# EAGLE design fitnessBuddy-TOP (EAGLE 9.6.2)
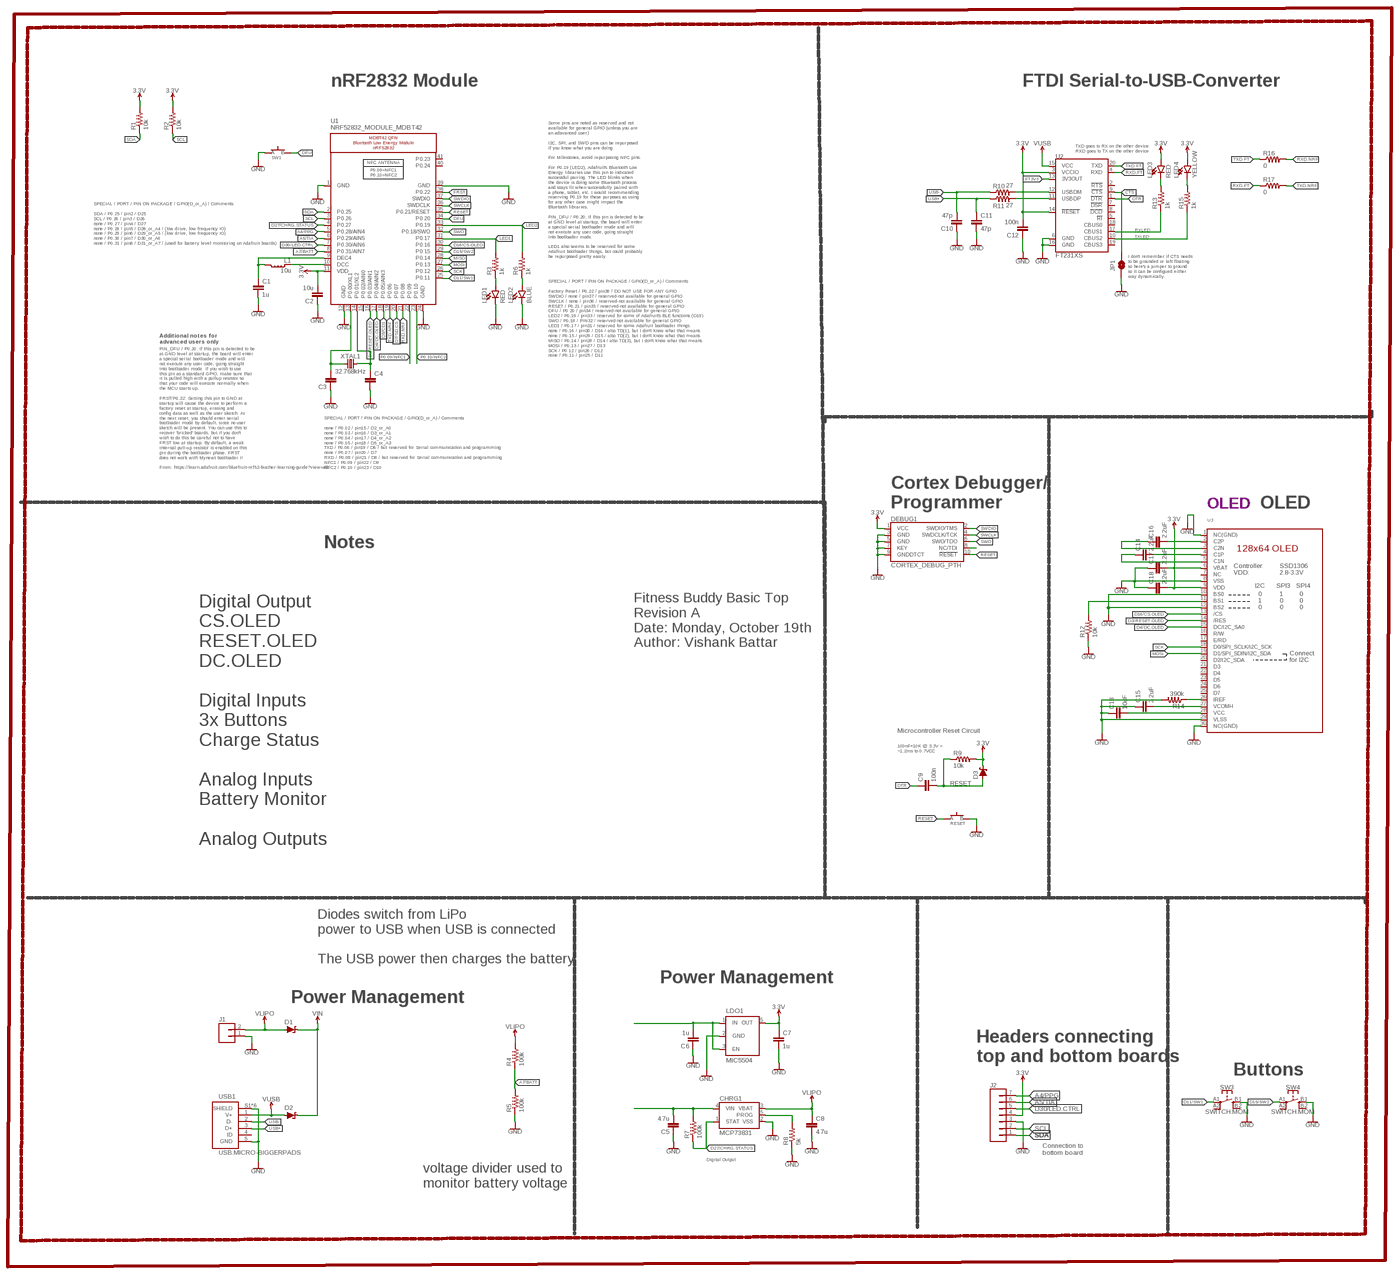
[diagram p0: schematic, sheet 1, overview]
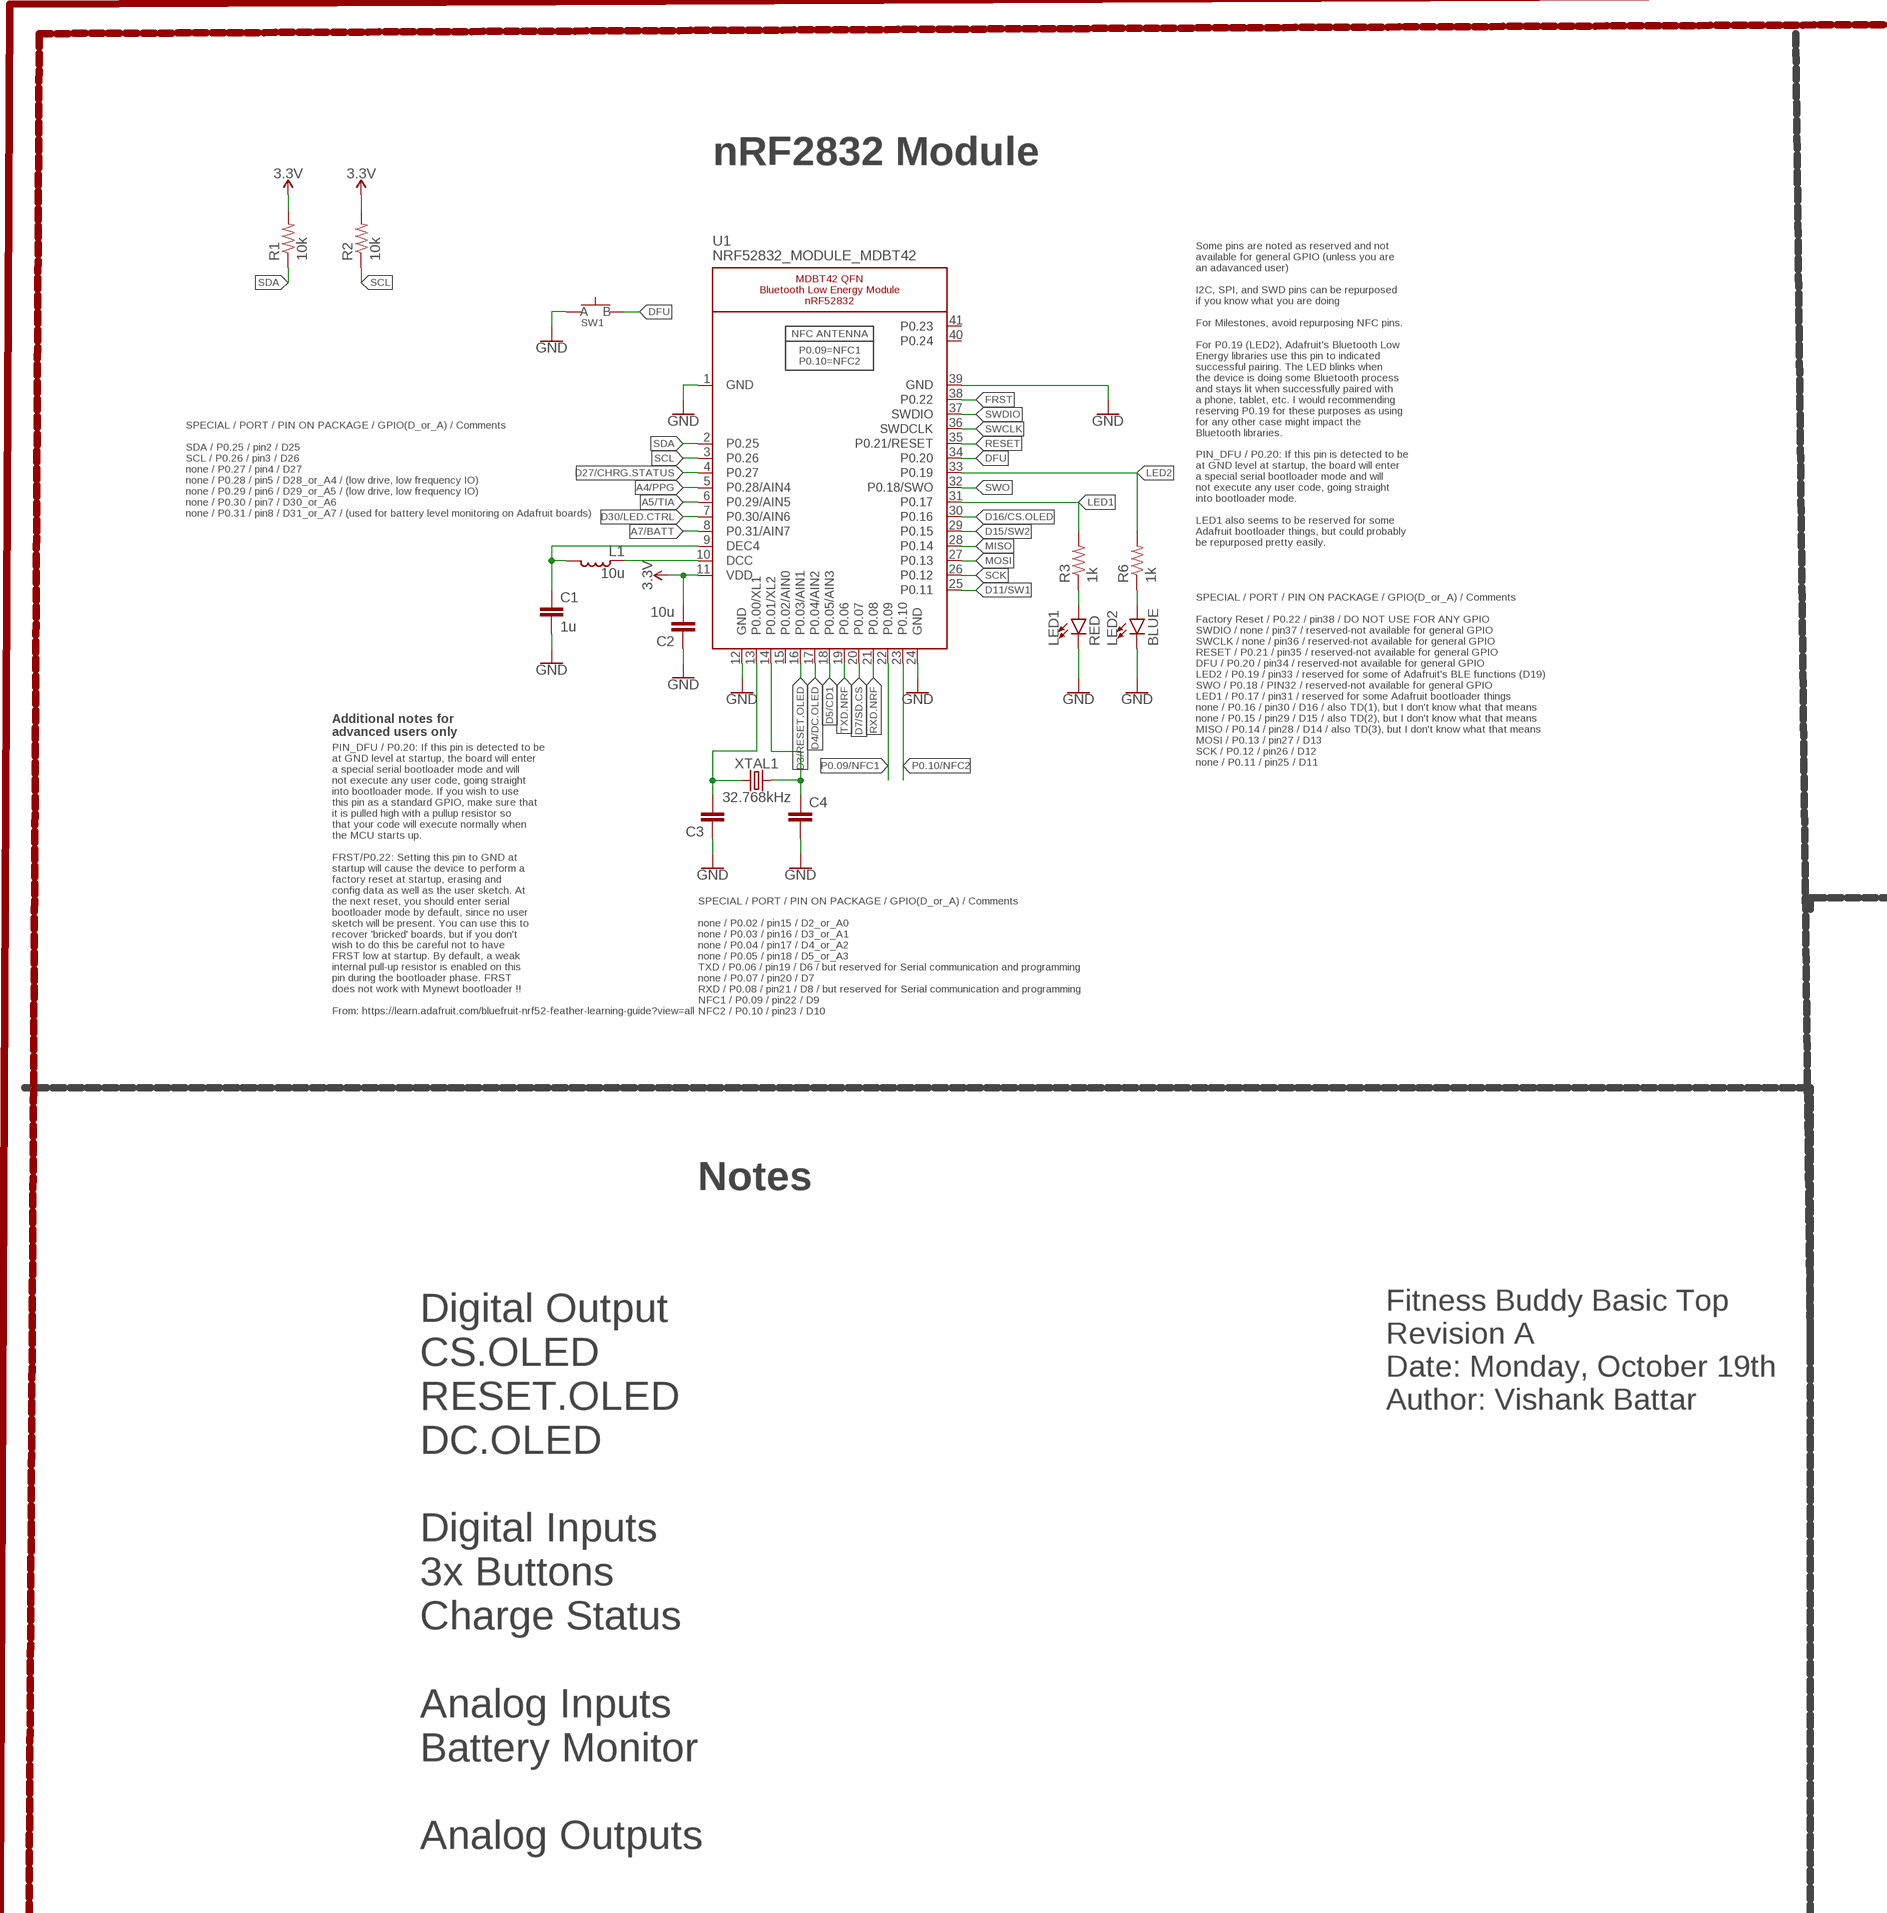
[diagram p1: schematic, sheet 1, part 1 of 4]
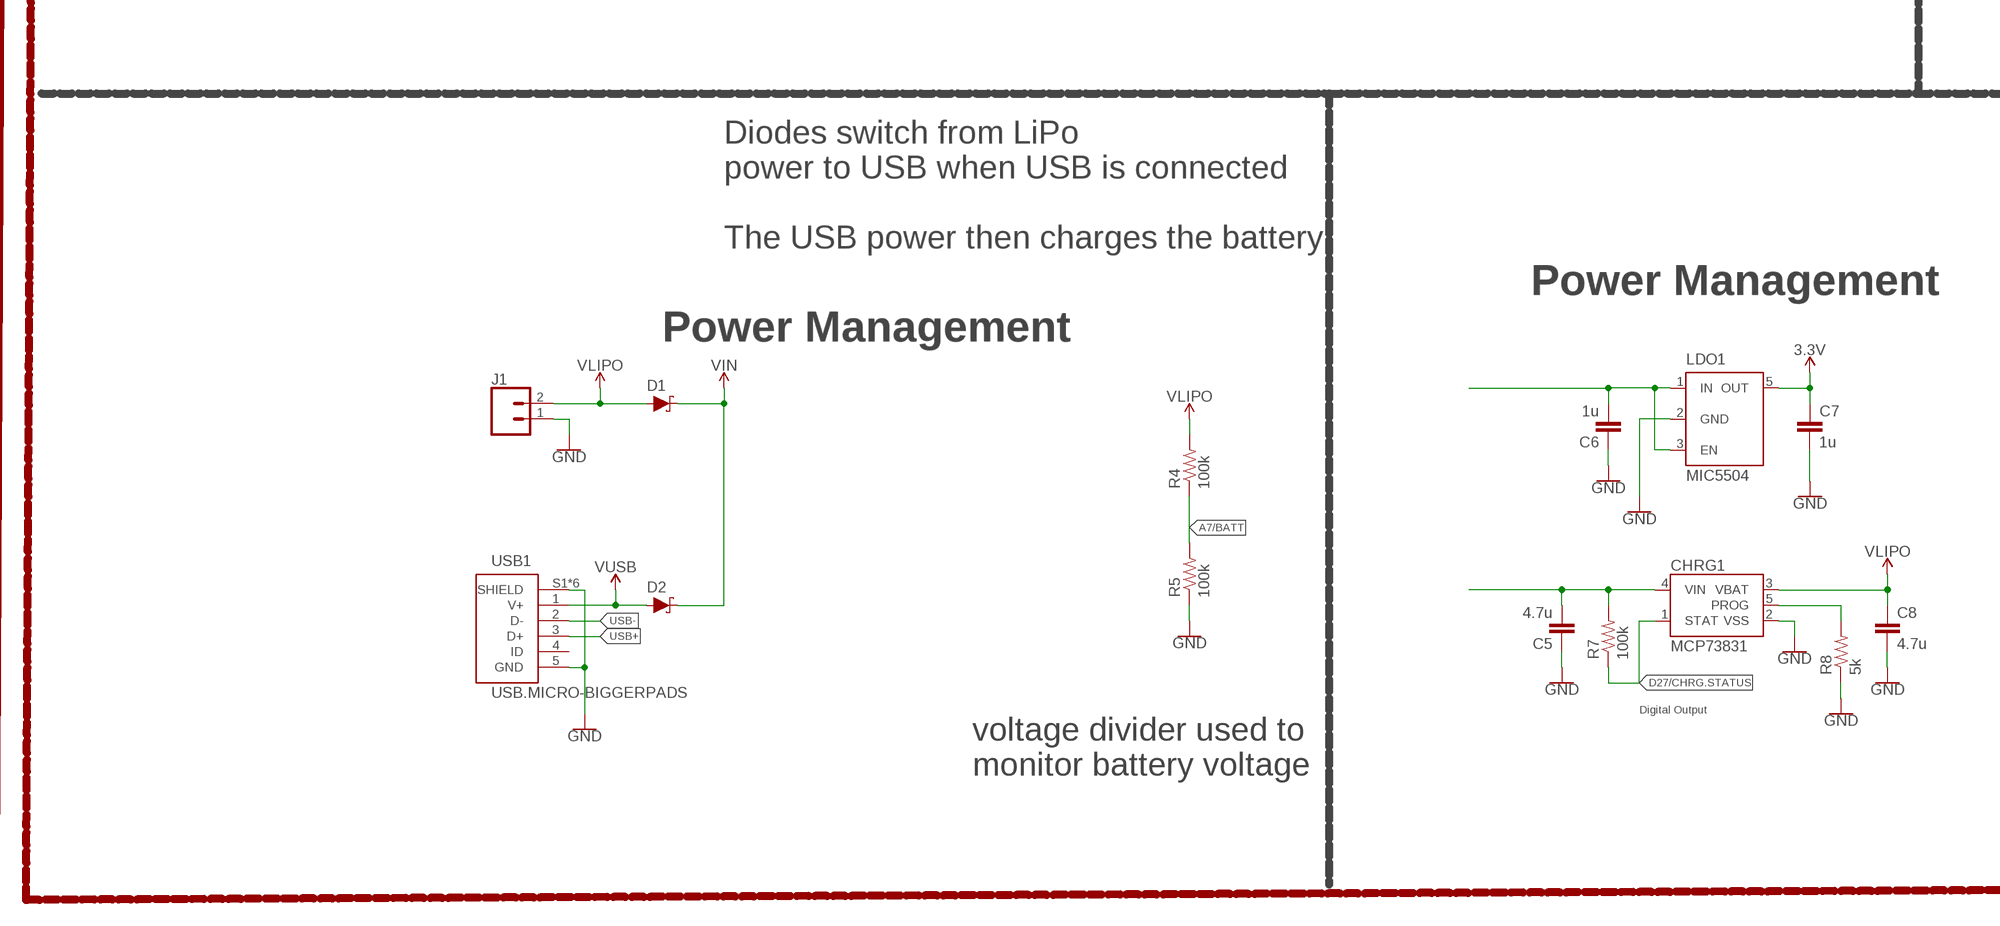
[diagram p2: schematic, sheet 1, part 2 of 4]
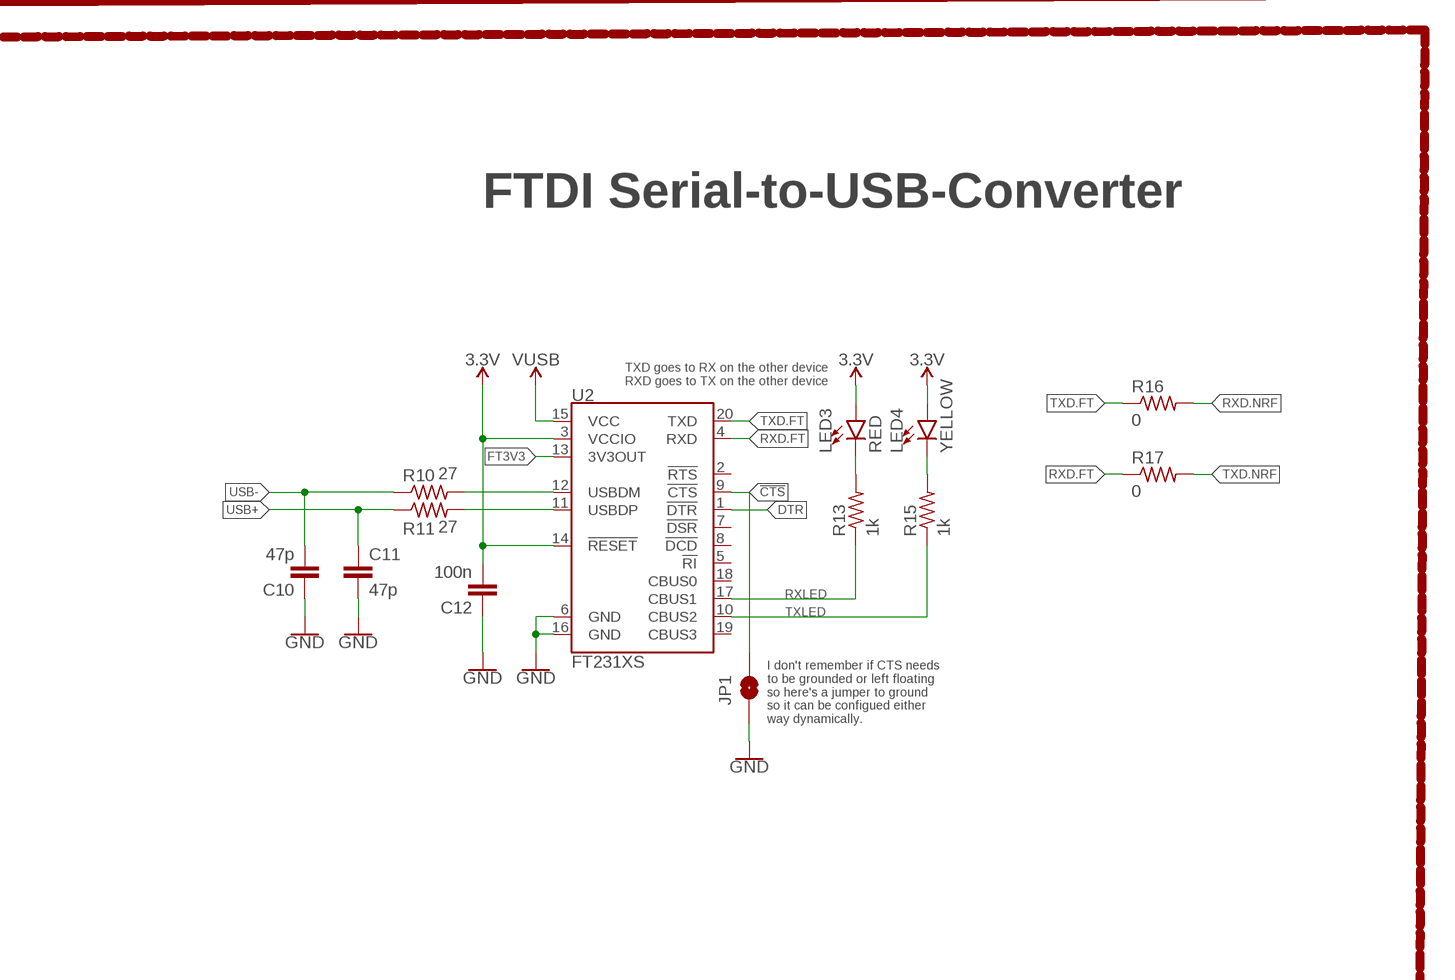
[diagram p3: schematic, sheet 1, part 3 of 4]
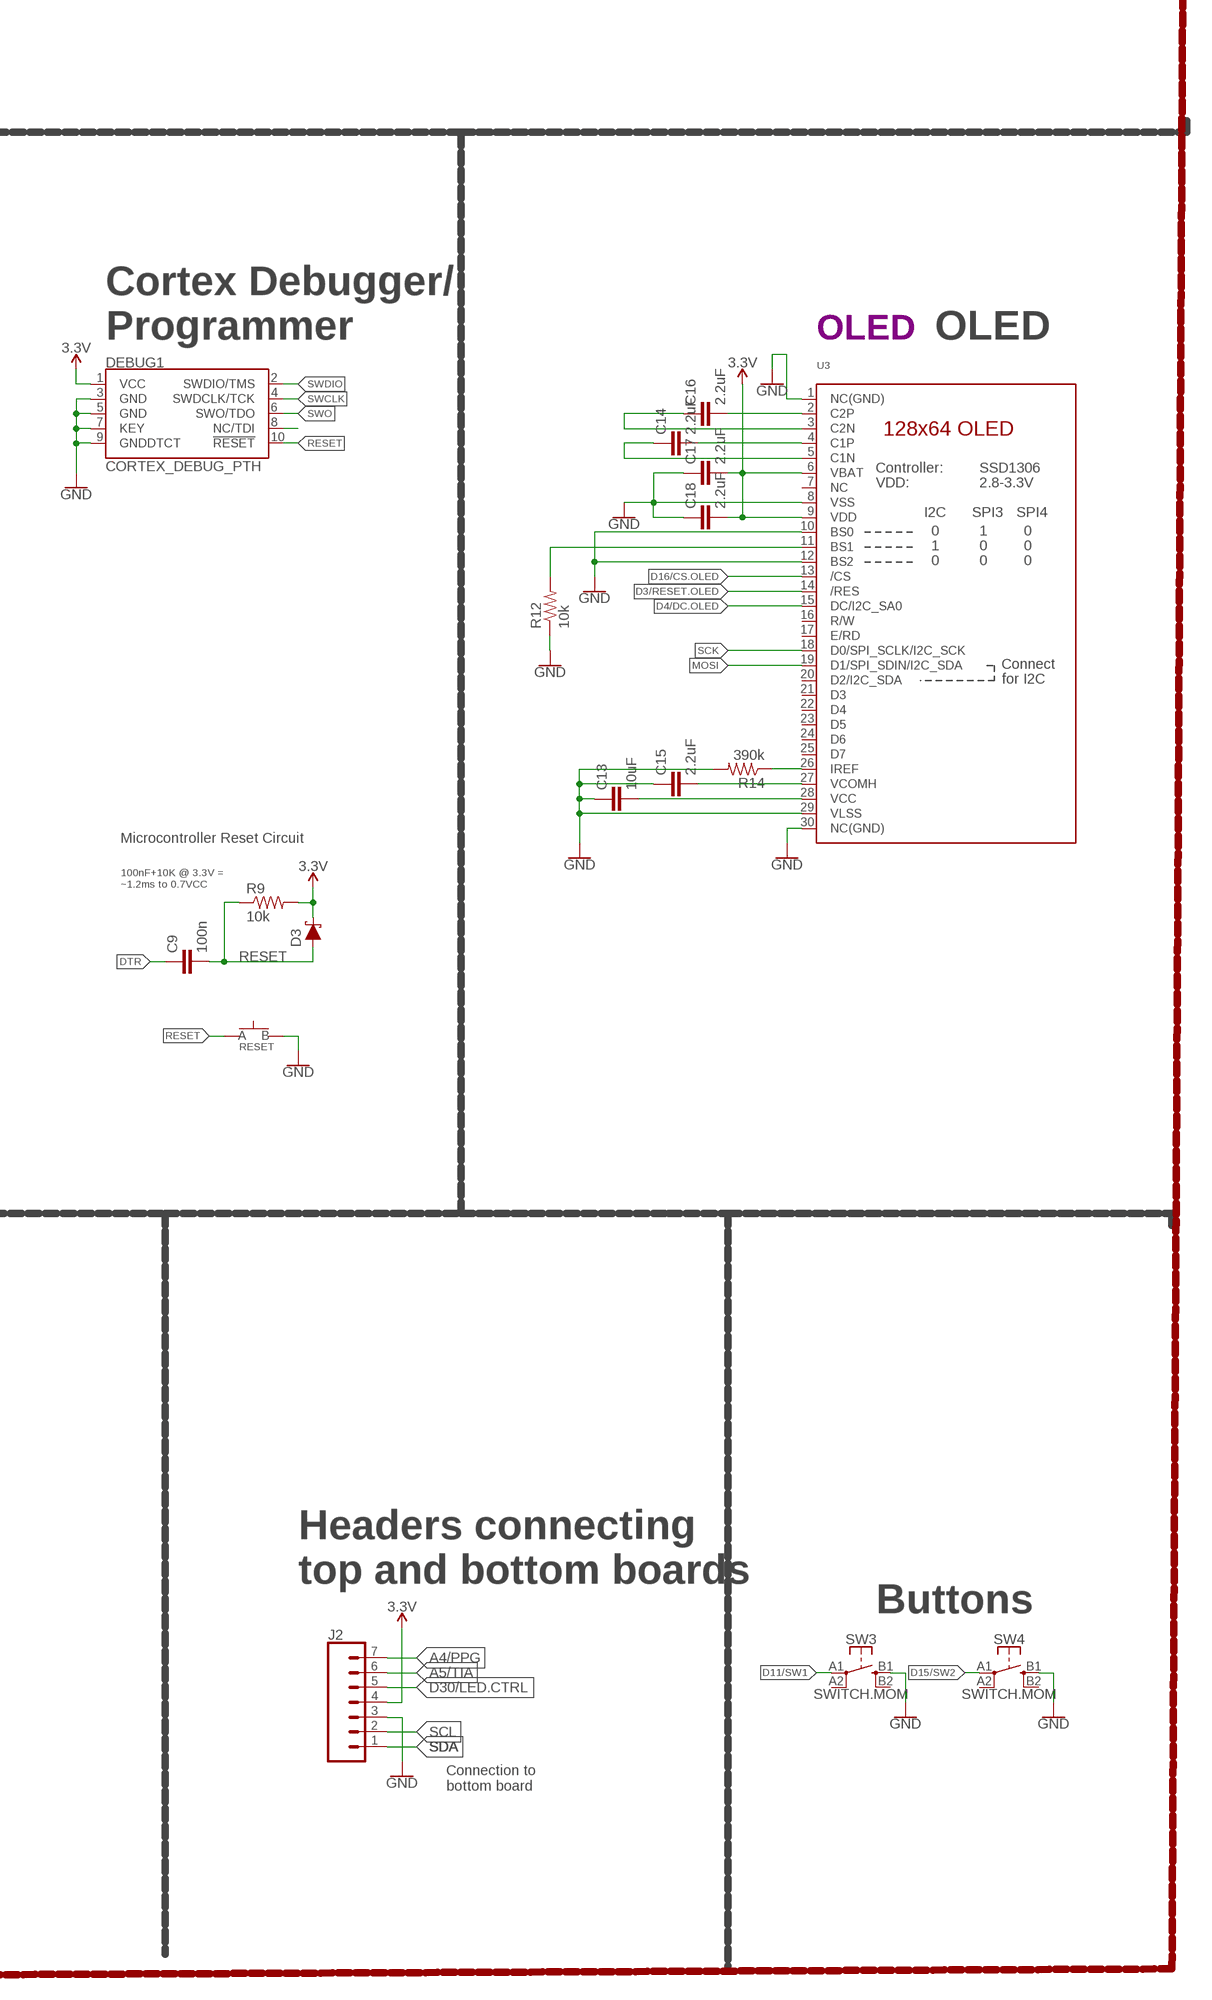
[diagram p4: schematic, sheet 1, part 4 of 4]

## Parts
C1  1u  CAPACITOR0603  [C0603]
C2  10u  CAPACITOR0805  [C0805]
C3  CAPACITOR0603  [C0603]
C4  CAPACITOR0603  [C0603]
C5  4.7u  CAPACITOR0603  [C0603]
C6  1u  CAPACITOR0603  [C0603]
C7  1u  CAPACITOR0603  [C0603]
C8  4.7u  CAPACITOR0603  [C0603]
C9  100n  CAPACITOR0603  [C0603]
C10  47p  CAPACITOR0603  [C0603]
C11  47p  CAPACITOR0603  [C0603]
C12  100n  CAPACITOR0603  [C0603]
C13  10uF  CAPACITOR0603  [C0603]
C14  2.2uF  CAPACITOR0402  [C0402]
C15  2.2uF  CAPACITOR0603  [C0603]
C16  2.2uF  CAPACITOR0402  [C0402]
C17  2.2uF  CAPACITOR0402  [C0402]
C18  2.2uF  CAPACITOR0402  [C0402]
CHRG1  MCP73831  [SOT23-5]
D1  SCHOTTKY-USC  [USC]
D2  SCHOTTKY-USC  [USC]
D3  SCHOTTKY-USC  [USC]
DEBUG1  CORTEX_DEBUG_PTH  [2X5-PTH-1.27MM]
J1  CONN_02  [1X02]
J2  CONN_07-1.27MM  [1X07_1.27MM]
JP1  JUMPER-SMT_2_NO_SILK  [SMT-JUMPER_2_NO_SILK]
L1  10u  INDUCTOR0603  [L0603]
LDO1  MIC5504  [SOT23-5]
LED1  RED  LED0603  [LED-0603]
LED2  BLUE  LED0603  [LED-0603]
LED3  RED  LED0603  [LED-0603]
LED4  YELLOW  LED0603  [LED-0603]
R1  10k  RESISTOR0603  [R0603]
R2  10k  RESISTOR0603  [R0603]
R3  1k  RESISTOR0603  [R0603]
R4  100k  RESISTOR0603  [R0603]
R5  100k  RESISTOR0603  [R0603]
R6  1k  RESISTOR0603  [R0603]
R7  100k  RESISTOR0603  [R0603]
R8  5k  RESISTOR0603  [R0603]
R9  10k  RESISTOR0603  [R0603]
R10  27  RESISTOR0603  [R0603]
R11  27  RESISTOR0603  [R0603]
R12  10k  RESISTOR0603  [R0603]
R13  1k  RESISTOR0603  [R0603]
R14  390k  RESISTOR0603  [R0603]
R15  1k  RESISTOR0603  [R0603]
R16  0  RESISTOR0603  [R0603]
R17  0  RESISTOR0603  [R0603]
RESET  SPST-PTS830GG140-COPY.1-3  [BUTTON-GULLWING]
SW1  SPST-PTS830GG140-COPY.1-3  [BUTTON-GULLWING]
SW3  SWITCH.MOM  [TACTILE_SWITCH_SMD_6.2MM_TALL]
SW4  SWITCH.MOM  [TACTILE_SWITCH_SMD_6.2MM_TALL]
U1  NRF52832_MODULE_MDBT42  [BLE_MODULE_RAYTAC_MDBT42]
U2  FT231XS  [SSOP20_L]
U3  DISP_OLED_UG-2864HSWEG01-NO-WRAPAROUND  [UG-2864HSWEG01_0.96IN_NO-WRAPAROUND]
USB1  USB.MICRO-BIGGERPADS  [USB-MICRO-01.BIGGERPADS]
XTAL1  32.768kHz  CRYSTALECS-.327-12.5-12-C-TR  [2-SMD.NOLEAD.2.0MMTO1.2MM]

## Nets
3.3V: C2.2 C7.1 C12.2 C17.2 C18.2 D3.-(C) DEBUG1.1(VCC) J2.4 LDO1.5(OUT) LED3.A LED4.A R1.2 R2.2 R9.2 U1.11(VDD) U2.3(VCCIO) U2.14(!RESET) U3.6(VBAT) U3.9(VDD)
!CTS: JP1.2 U2.9(!CTS)
A4/PPG: J2.7 U1.5(P0.28/AIN4)
A5/TIA: J2.6 U1.6(P0.29/AIN5)
A7/BATT: R4.1 R5.2 U1.8(P0.31/AIN7)
D3/RESET.OLED: U1.16(P0.03/AIN1) U3.14(/RES)
D4/DC.OLED: U1.17(P0.04/AIN2) U3.15(DC/I2C_SA0)
D5/CD1: U1.18(P0.05/AIN3)
D7/SD.CS: U1.20(P0.07)
D11/SW1: SW3.A1 U1.25(P0.11)
D15/SW2: SW4.A1 U1.29(P0.15)
D16/CS.OLED: U1.30(P0.16) U3.13(/CS)
D27/CHRG.STATUS: CHRG1.1(STAT) R7.1 U1.4(P0.27)
D30/LED.CTRL: J2.5 U1.7(P0.30/AIN6)
DFU: SW1.3(B) U1.34(P0.20)
DTR: C9.1 U2.1(!DTR)
FRST: U1.38(P0.22)
FT3V3: U2.13(3V3OUT)
GND: C1.2 C2.1 C3.1 C4.2 C5.1 C6.1 C7.2 C8.2 C10.1 C11.2 C12.1 C13.1 C15.1 C17.1 C18.1 CHRG1.2(VSS) DEBUG1.3(GND) DEBUG1.5(GND) DEBUG1.7(KEY) DEBUG1.9(GNDDTCT) J1.1 J2.3 JP1.1 LDO1.2(GND) LED1.C LED2.C R5.1 R8.1 R12.1 R14.2 RESET.3(B) SW1.1(A) SW3.B1 SW4.B1 U1.1(GND) U1.12(GND) U1.24(GND) U1.39(GND) U2.6(GND) U2.16(GND) U3.1(NC(GND)) U3.8(VSS) U3.10(BS0) U3.12(BS2) U3.29(VLSS) U3.30(NC(GND)) USB1.5(GND) USB1.S1(SHIELD) USB1.S2(SHIELD) USB1.S3(SHIELD) USB1.S4(SHIELD) USB1.S5(SHIELD) USB1.S6(SHIELD)
LED1: R3.2 U1.31(P0.17)
LED2: R6.2 U1.33(P0.19)
MISO: U1.28(P0.14)
MOSI: U1.27(P0.13) U3.19(D1/SPI_SDIN/I2C_SDA)
N$1: R12.2 U3.11(BS1)
N$2: R14.1 U3.26(IREF)
N$3: C16.2 U3.2(C2P)
N$4: C3.2 U1.13(P0.00/XL1) XTAL1.P$1
N$5: C16.1 U3.3(C2N)
N$6: C4.1 U1.14(P0.01/XL2) XTAL1.P$2
N$7: C14.2 U3.4(C1P)
N$8: C14.1 U3.5(C1N)
N$9: LED1.A R3.1
N$10: LED2.A R6.1
N$11: L1.1 U1.10(DCC)
N$12: C1.1 L1.2 U1.9(DEC4)
N$13: C13.2 U3.28(VCC)
N$14: DEBUG1.8(NC/TDI)
N$15: C15.2 U3.27(VCOMH)
N$16: CHRG1.5(PROG) R8.2
N$17: C5.2 CHRG1.4(VIN) R7.2
N$23: R10.2 U2.12(USBDM)
N$24: R11.2 U2.11(USBDP)
N$25: LED3.C R13.2
N$26: LED4.C R15.2
P0.09/NFC1: U1.22(P0.09)
P0.10/NFC2: U1.23(P0.10)
RESET: C9.2 D3.+(A) DEBUG1.10(!RESET) R9.1 RESET.1(A) U1.35(P0.21/RESET)
RXD.FT: R17.1 U2.4(RXD)
RXD.NRF: R16.2 U1.21(P0.08)
RXLED: R13.1 U2.17(CBUS1)
SCK: U1.26(P0.12) U3.18(D0/SPI_SCLK/I2C_SCK)
SCL: J2.2 R2.1 U1.3(P0.26)
SDA: J2.1 R1.1 U1.2(P0.25)
SWCLK: DEBUG1.4(SWDCLK/TCK) U1.36(SWDCLK)
SWDIO: DEBUG1.2(SWDIO/TMS) U1.37(SWDIO)
SWO: DEBUG1.6(SWO/TDO) U1.32(P0.18/SWO)
TXD.FT: R16.1 U2.20(TXD)
TXD.NRF: R17.2 U1.19(P0.06)
TXLED: R15.1 U2.10(CBUS2)
USB+: C11.1 R11.1 USB1.3(D+)
USB-: C10.2 R10.1 USB1.2(D-)
V_USB: D2.+(A) U2.15(VCC) USB1.1(V+) ; supply symbol labelled VUSB
VIN: C6.2 D1.-(C) D2.-(C) LDO1.1(IN) LDO1.3(EN)
VLIPO: C8.1 CHRG1.3(VBAT) D1.+(A) J1.2 R4.2
Unconnected: SW3.A2 SW3.B2 SW4.A2 SW4.B2 U1.15(P0.02/AIN0) U1.40(P0.24) U1.41(P0.23) U2.2(!RTS) U2.5(!RI) U2.7(!DSR) U2.8(!DCD) U2.18(CBUS0) U2.19(CBUS3) U3.7(NC) U3.16(R/W) U3.17(E/RD) U3.20(D2/I2C_SDA) U3.21(D3) U3.22(D4) U3.23(D5) U3.24(D6) U3.25(D7) USB1.4(ID)

## Notes on the sheet
- nRF2832 Module | FTDI Serial-to-USB-Converter
- TXD goes to RX on the other device
  RXD goes to TX on the other device
- SPECIAL / PORT / PIN ON PACKAGE / GPIO(D_or_A) / Comments
  
  SDA / P0.25 / pin2 / D25
  SCL / P0.26 / pin3 / D26
  none / P0.27 / pin4 / D27
  none / P0.28 / pin5 / D28_or_A4 / (low drive, low frequency IO)
  none / P0.29 / pin6 / D29_or_A5 / (low drive, low frequency IO)
  none / P0.30 / pin7 / D30_or_A6
  none / P0.31 / pin8 / D31_or_A7 / (used for battery level monitoring on Adafruit boards)
- Some pins are noted as reserved and not
  available for general GPIO (unless you are
  an adavanced user)
  
  I2C, SPI, and SWD pins can be repurposed
  if you know what you are doing
  
  For Milestones, avoid repurposing NFC pins.
  
  For P0.19 (LED2), Adafruit's Bluetooth Low
  Energy libraries use this pin to indicated
  successful pairing. The LED blinks when
  the device is doing some Bluetooth process
  and stays lit when successfully paired with
  a phone, tablet, etc. I would recommending
  reserving P0.19 for these purposes as using
  for any other case might impact the
  Bluetooth libraries.
  
  PIN_DFU / P0.20: If this pin is detected to be
  at GND level at startup, the board will enter
  a special serial bootloader mode and will
  not execute any user code, going straight
  into bootloader mode.
  
  LED1 also seems to be reserved for some
  Adafruit bootloader things, but could probably
  be repurposed pretty easily.
- I don't remember if CTS needs
  to be grounded or left floating
  so here's a jumper to ground
  so it can be configued either
  way dynamically.
- Additional notes for
  advanced users only
- SPECIAL / PORT / PIN ON PACKAGE / GPIO(D_or_A) / Comments
  
  Factory Reset / P0.22 / pin38 / DO NOT USE FOR ANY GPIO
  SWDIO / none / pin37 / reserved-not available for general GPIO
  SWCLK / none / pin36 / reserved-not available for general GPIO
  RESET / P0.21 / pin35 / reserved-not available for general GPIO
  DFU / P0.20 / pin34 / reserved-not available for general GPIO
  LED2 / P0.19 / pin33 / reserved for some of Adafruit's BLE functions (D19)
  SWO / P0.18 / PIN32 / reserved-not available for general GPIO
  LED1 / P0.17 / pin31 / reserved for some Adafruit bootloader things
  none / P0.16 / pin30 / D16 / also TD(1), but I don't know what that means
  none / P0.15 / pin29 / D15 / also TD(2), but I don't know what that means
  MISO / P0.14 / pin28 / D14 / also TD(3), but I don't know what that means
  MOSI / P0.13 / pin27 / D13
  SCK / P0.12 / pin26 / D12
  none / P0.11 / pin25 / D11
- PIN_DFU / P0.20: If this pin is detected to be
  at GND level at startup, the board will enter
  a special serial bootloader mode and will
  not execute any user code, going straight
  into bootloader mode. If you wish to use
  this pin as a standard GPIO, make sure that
  it is pulled high with a pullup resistor so
  that your code will execute normally when
  the MCU starts up.
  
  FRST/P0.22: Setting this pin to GND at
  startup will cause the device to perform a
  factory reset at startup, erasing and
  config data as well as the user sketch. At
  the next reset, you should enter serial
  bootloader mode by default, since no user
  sketch will be present. You can use this to
  recover 'bricked' boards, but if you don't
  wish to do this be careful not to have
  FRST low at startup. By default, a weak
  internal pull-up resistor is enabled on this
  pin during the bootloader phase. FRST
  does not work with Mynewt bootloader !!
  
  From: https://learn.adafruit.com/bluefruit-nrf52-feather-learning-guide?view=all
- SPECIAL / PORT / PIN ON PACKAGE / GPIO(D_or_A) / Comments
  
  none / P0.02 / pin15 / D2_or_A0
  none / P0.03 / pin16 / D3_or_A1
  none / P0.04 / pin17 / D4_or_A2
  none / P0.05 / pin18 / D5_or_A3
  TXD / P0.06 / pin19 / D6 / but reserved for Serial communication and programming
  none / P0.07 / pin20 / D7
  RXD / P0.08 / pin21 / D8 / but reserved for Serial communication and programming
  NFC1 / P0.09 / pin22 / D9
  NFC2 / P0.10 / pin23 / D10
- Cortex Debugger/
  Programmer
- OLED | OLED
- Notes
- Fitness Buddy Basic Top
  Revision A
  Date: Monday, October 19th
  Author: Vishank Battar
- Microcontroller Reset Circuit
- 100nF+10K @ 3.3V =
  ~1.2ms to 0.7VCC
- Digital Output
  CS.OLED
  RESET.OLED
  DC.OLED
  
  Digital Inputs
  3x Buttons
  Charge Status
  
  Analog Inputs
  Battery Monitor
  
  Analog Outputs
- Diodes switch from LiPo
  power to USB when USB is connected
  
  The USB power then charges the battery
- Power Management
- Power Management
- Headers connecting
  top and bottom boards
- Buttons
- Connection to
  bottom board
- Digital Output
- voltage divider used to
  monitor battery voltage

## Library data of the parts
C1-C18 = LinnesLab-Passives:CAPACITOR
CHRG1 = LinnesLab-Power:MCP73831: MCP73831T Li-Ion, Li-Pol Controller Miniature single cell, fully integrated Li-Ion, Li-polymer charge management controller Datasheet <http://ww1.microchip.com/downloads/en/DeviceDoc/20001984g.pdf> SparkFun Products: SparkFun ESP32 Thing <https://www.sparkfun.com/products/13907> SparkFun 9DoF Razor IMU M0 <https://www.sparkfun.com/products/14001>; PROD_ID: IC-09995
D1-D3 = LinnesLab-DiscreteSemi:SCHOTTKY: Schottky diode A Schottky diode is a semiconductor diode which has a low forward voltage drop and a very fast switching action. Example: Digi-Key Part Number: RB161MM-20CT-ND
DEBUG1 = LinnesLab-Connectors:CORTEX_DEBUG: Cortex Debug Connector - 10 pin Supports JTAG debug, Serial Wire debug, and Serial Wire Viewer. PTH and SMD connector options available. General Connector Information <http://infocenter.arm.com/help/topic/com.arm.doc.faqs/attached/13634/cortex_debug_connectors.pdf> Products: PTH Connector <http://www.digikey.com/product-detail/en/cnc-tech/3220-10-0100-00/1175-1627-ND/3883661> -via Digi-Key SparkFun PSoc <https://www.sparkfun.com/products/13229> SparkFun T <https://www.sparkfun.com/products/13810>
J1 = LinnesLab-Connectors:CONN_02: Multi connection point. Often used as Generic Header-pin footprint for 0.1 inch spaced/style header connections On any of the 0.1 inch spaced packages, you can populate with these: Break Away Headers - Straight <https://www.sparkfun.com/products/116> (PRT-00116) Break Away Male Headers - Right Angle <https://www.sparkfun.com/products/553> (PRT-00553) Female Headers <https://www.sparkfun.com/products/115> (PRT-00115) Break Away Headers - Machine Pin <https://www.sparkfun.com/products/117> (PRT-00117) Break Away Female Headers - Swiss Machine Pin <https://www.sparkfun.com/products/743> (PRT-00743) For SCREWTERMINALS and SPRING TERMINALS visit here: Screw Terimnals on SparkFun.com <https://www.sparkfun.com/search/results?term=Screw+Terminals> (5mm/3.5mm/2.54mm spacing) This device is also useful as a general connection point to wire up your design to another part of your project. Our various solder wires solder well into these plated through hole pads. Hook-Up Wire - Assortment (Stranded, 22 AWG) <https://www.sparkfun.com/products/11375> (PRT-11375) Hook-Up Wire - Assortment (Solid Core, 22 AWG) <https://www.sparkfun.com/products/11367> (PRT-11367) View the entire wire category on our website here <https://www.sparkfun.com/categories/141> Special notes: Molex polarized connector foot print use with: PRT-08233 with associated crimp pins and housings. 2.54_SCREWTERM for use with PRT-10571. 3.5mm Screw Terminal footprints for PRT-08084 5mm Screw Terminal footprints for use with PRT-08432
J2 = LinnesLab-Connectors:CONN_07: Multi connection point. Often used as Generic Header-pin footprint for 0.1 inch spaced/style header connections On any of the 0.1 inch spaced packages, you can populate with these: Break Away Headers - Straight <https://www.sparkfun.com/products/116> (PRT-00116) Break Away Male Headers - Right Angle <https://www.sparkfun.com/products/553> (PRT-00553) Female Headers <https://www.sparkfun.com/products/115> (PRT-00115) Break Away Headers - Machine Pin <https://www.sparkfun.com/products/117> (PRT-00117) Break Away Female Headers - Swiss Machine Pin <https://www.sparkfun.com/products/743> (PRT-00743) For SCREWTERMINALS and SPRING TERMINALS visit here: Screw Terimnals on SparkFun.com <https://www.sparkfun.com/search/results?term=Screw+Terminals> (5mm/3.5mm/2.54mm spacing) This device is also useful as a general connection point to wire up your design to another part of your project. Our various solder wires solder well into these plated through hole pads. Hook-Up Wire - Assortment (Stranded, 22 AWG) <https://www.sparkfun.com/products/11375> (PRT-11375) Hook-Up Wire - Assortment (Solid Core, 22 AWG) <https://www.sparkfun.com/products/11367> (PRT-11367) View the entire wire category on our website here <https://www.sparkfun.com/categories/141> Special notes: Molex polarized connector foot print use with SKU : PRT-08231 with associated crimp pins and housings. 1MM SMD Version SKU: PRT-10208 NOTES ON THE VARIANTS LOCK and LOCK_LONGPADS... This footprint was designed to help hold the alignment of a through-hole component (i.e. 6-pin header) while soldering it into place. You may notice that each hole has been shifted either up or down by 0.005 of an inch from it's more standard position (which is a perfectly straight line). This slight alteration caused the pins (the squares in the middle) to touch the edges of the holes. Because they are alternating, it causes a "brace" to hold the component in place. 0.005 has proven to be the perfect amount of "off-center" position when using our standard breakaway headers. Although looks a little odd when you look at the bare footprint, once you have a header in there, the alteration is very hard to notice. Also,if you push a header all the way into place, it is covered up entirely on the bottom side.
JP1 = LinnesLab-Switches:JUMPER-SMT_2_NO: Normally open jumper This jumper has two pads in close proximity to each other. Apply solder to close the connection. Round pads are easier to solder for beginners, but are a lot larger. SparkFun Product that uses the round pads: SparkFun EL Sequencer <https://www.sparkfun.com/products/12781>
L1 = LinnesLab-Passives:INDUCTOR
LDO1 = LinnesLab-Power:MIC5504: MIC5504 Voltage Regulator Output Voltages: 1.0V to 3.3V Input Voltages: 2.5V to 5.5V Link to Datasheet http://ww1.microchip.com/downloads/en/DeviceDoc/MIC550X.pdf
LED1-LED4 = LinnesLab-LED:LED: LED (Generic) Standard schematic elements and footprints for 5mm, 3mm, 1206, and 0603 sized LEDs. Generic LEDs with no color specified. LTST-C190KGKT: arrow indicates cathode
R1-R17 = LinnesLab-Passives:RESISTOR
RESET SW1 = LinnesLab-Switches:SPST-PTS830GG140-COPY
SW3 SW4 = LinnesLab-Switches:SWITCH.MOM: PTS645SM43SMTR92 LFS
U1 = LinnesLab-Microcontrollers:NRF52832_MODULE_MDBT42: MDBT42 - BLE Module (nRF52832 QFN) VDD: 1.7-3.6V
U2 = LinnesLab-DigitalIC:FT231X: FTDI FT231X Full Speed USB to Full-handshake UART This USB2.0 Full Speed IC offers a compact bridge to full handshake UART interfaces. The device is a UART, capable of operating up to 3MBaud, with low power consumption (8mA). The FT231X includes the complete FT-X series feature set and enables USB to be added into a system design quickly and easily over a UART interface. Datasheet <http://cdn.sparkfun.com/datasheets/Components/General%20IC/DS_FT231X.pdf>; DIGIKEY: 768-1156-5-ND; MFN: FT231XS-U
U3 = LinnesLab-Displays:DISP_OLED_UG-2864HSWEG01: UG-2864HSWEG01 OLED display Both 1.3" and 0.96" models share the same FPC tab footprint, only the screen dimensions vary.
USB1 = LinnesLab-Connectors:USB.MICRO: DigiKey PN: 609-4613-1-ND
XTAL1 = LinnesLab-Clocks:CRYSTAL

## Board
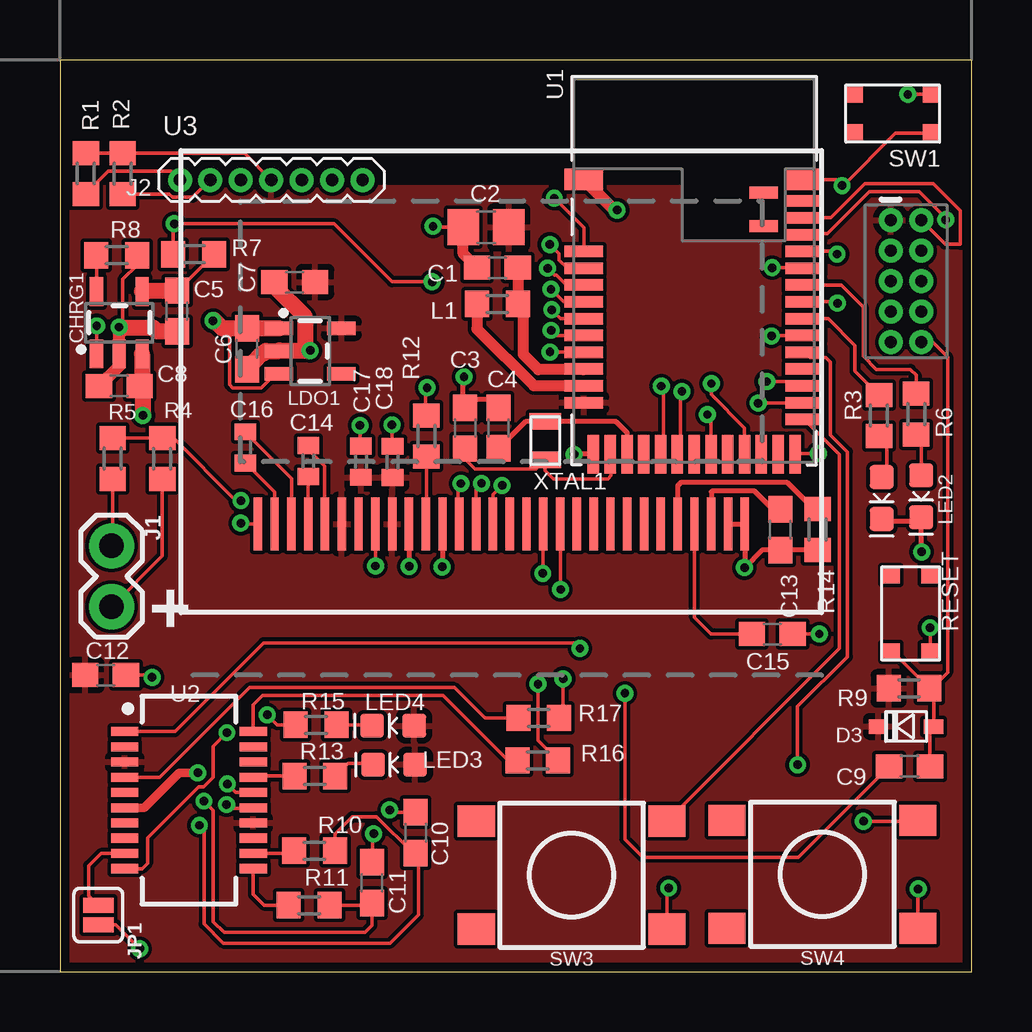
[diagram p5: board, top side]
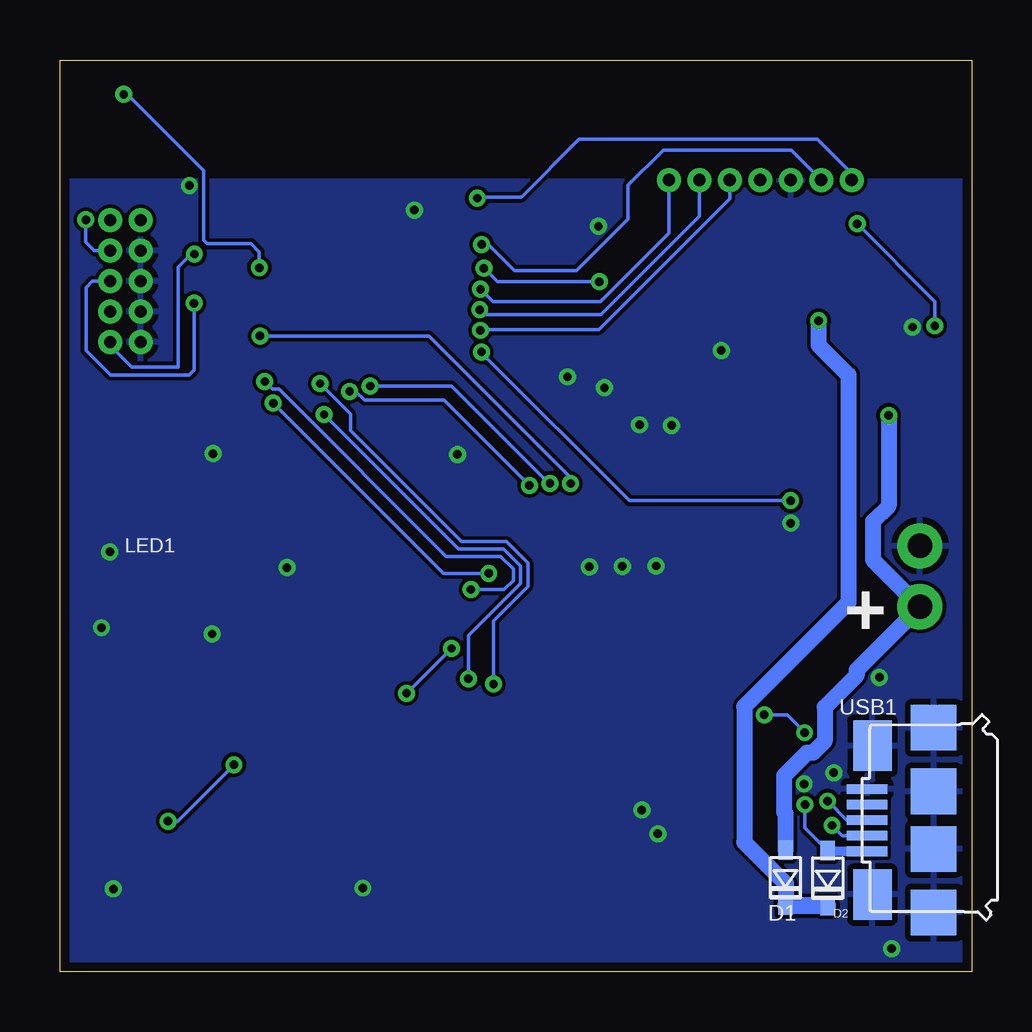
[diagram p6: board, bottom side, seen from below]

Size 38 x 38 mm. Coordinates in mm from the lower left corner, seen from the top.
Outline: 0,0 38,0 38,38 0,38 0,0
Copper layers (1*16): Top 0.0356mm / dielectric 1.5011mm / Bottom 0.0356mm
Design rules "LaenPCBOrder": minimum track width 6mil, minimum drill 13mil, track to track 6mil, track to pad 6mil, pad to pad 6mil, via to via 6mil, smd to smd 6mil, copper to edge 15mil, drill to drill 6mil, minimum pad ring 7mil, minimum via ring 7mil, stop-mask expansion 3mil, vias tented up to drill 0mil, thermal gap 10mil

### Footprints (pad centres in the part's own frame; a part is rotated, then mirrored left to right if it is on the bottom)
C0603 = smd 1.1 x 1: 1 -0.85,0; 2 0.85,0
C0805 = smd 1.3 x 1.5: 1 -0.95,0; 2 0.95,0
C0402 = smd 0.7 x 0.9: 1 -0.65,0; 2 0.65,0
SOT23-5 = smd 0.55 x 1.2: 1 -0.95,-1.3; 2 0,-1.3; 3 0.95,-1.3; 4 0.95,1.3; 5 -0.95,1.3
USC = smd 0.8 x 0.6: + -1.15,0; - 1.15,0
2X5-PTH-1.27MM = drill 0.508 pad 1: 1 -2.54,-0.635; 2 -2.54,0.635; 3 -1.27,-0.635; 4 -1.27,0.635; 5 0,-0.635; 6 0,0.635; 7 1.27,-0.635; 8 1.27,0.635; 9 2.54,-0.635; 10 2.54,0.635
1X02 = drill 1.016 pad 1.88: 1 0,0; 2 2.54,0
1X07_1.27MM = drill 0.508 pad 1: 1 0,0; 2 1.27,0; 3 2.54,0; 4 3.81,0; 5 5.08,0; 6 6.35,0; 7 7.62,0
SMT-JUMPER_2_NO_SILK = smd 0.635 x 1.27: 1 -0.406,0; 2 0.406,0
L0603 = smd 1 x 1.1: 1 -0.85,0; 2 0.85,0
LED-0603 = smd 1 x 1: A -0.877,0; C 0.877,0
R0603 = smd 1 x 1.1: 1 -0.85,0; 2 0.85,0
BUTTON-GULLWING = smd 0.7 x 0.75: 1 -1.6,0.825; 2 1.6,0.825; 3 -1.6,-0.825; 4 1.6,-0.825
TACTILE_SWITCH_SMD_6.2MM_TALL = smd 1.55 x 1.3: A1 -3.975,-2.25; A2 3.975,-2.25; B1 -3.975,2.25; B2 3.975,2.25
BLE_MODULE_RAYTAC_MDBT42 = smd 1.6 x 0.9: 1 -4.6,3.8; 39 4.6,3.8 | smd 1.6 x 0.48: 2 -4.6,0.8; 3 -4.6,0.1; 4 -4.6,-0.6; 5 -4.6,-1.3; 6 -4.6,-2; 7 -4.6,-2.7; 8 -4.6,-3.4; 9 -4.6,-4.1; 10 -4.6,-4.8; 11 -4.6,-5.5; 25 4.6,-6.2; 26 4.6,-5.5; 27 4.6,-4.8; 28 4.6,-4.1; 29 4.6,-3.4; 30 4.6,-2.7; 31 4.6,-2; 32 4.6,-1.3; 33 4.6,-0.6; 34 4.6,0.1; 35 4.6,0.8; 36 4.6,1.5; 37 4.6,2.2; 38 4.6,2.9 | smd 0.48 x 1.6: 12 -4.2,-7.65; 13 -3.5,-7.65; 14 -2.8,-7.65; 15 -2.1,-7.65; 16 -1.4,-7.65; 17 -0.7,-7.65; 18 0,-7.65; 19 0.7,-7.65; 20 1.4,-7.65; 21 2.1,-7.65; 22 2.8,-7.65; 23 3.5,-7.65; 24 4.2,-7.65 | smd 1.2 x 0.5: 40 2.9,3.25; 41 2.9,1.85
SSOP20_L = smd 0.381 x 1.143: 1 -2.857,-2.68; 2 -2.223,-2.68; 3 -1.587,-2.68; 4 -0.953,-2.68; 5 -0.318,-2.68; 6 0.318,-2.68; 7 0.953,-2.68; 8 1.587,-2.68; 9 2.223,-2.68; 10 2.857,-2.68; 11 2.857,2.68; 12 2.223,2.68; 13 1.587,2.68; 14 0.953,2.68; 15 0.318,2.68; 16 -0.318,2.68; 17 -0.953,2.68; 18 -1.587,2.68; 19 -2.223,2.68; 20 -2.857,2.68
UG-2864HSWEG01_0.96IN_NO-WRAPAROUND = smd 0.35 x 2.2: 1 -10.15,-1.2; 2 -9.45,-1.2; 3 -8.75,-1.2; 4 -8.05,-1.2; 5 -7.35,-1.2; 6 -6.65,-1.2; 7 -5.95,-1.2; 8 -5.25,-1.2; 9 -4.55,-1.2; 10 -3.85,-1.2; 11 -3.15,-1.2; 12 -2.45,-1.2; 13 -1.75,-1.2; 14 -1.05,-1.2; 15 -0.35,-1.2; 16 0.35,-1.2; 17 1.05,-1.2; 18 1.75,-1.2; 19 2.45,-1.2; 20 3.15,-1.2; 21 3.85,-1.2; 22 4.55,-1.2; 23 5.25,-1.2; 24 5.95,-1.2; 25 6.65,-1.2; 26 7.35,-1.2; 27 8.05,-1.2; 28 8.75,-1.2; 29 9.45,-1.2; 30 10.15,-1.2
USB-MICRO-01.BIGGERPADS = smd 0.4 x 1.7: 1 -1.3,1.505; 2 -0.65,1.505; 3 0,1.505; 4 0.65,1.505; 5 1.3,1.505 | smd 1.9 x 1.9: S1 -3.85,-1.27; S2 -1.2,-1.27; S3 1.2,-1.27; S4 3.85,-1.27 | smd 2.1 x 1.6: S5 -3.1,1.28; S6 3.1,1.28
2-SMD.NOLEAD.2.0MMTO1.2MM = smd 0.7 x 1.3: P$1 -0.8,0; P$2 0.8,0

### Placement (x,y rotation side)
C1  18.23,29.34 180 top
C2  17.76,31.02 0 top
C3  16.89,22.65 270 top
C4  18.29,22.65 90 top
C5  4.88,27.54 90 top
C6  7.8,25.96 90 top
C7  9.79,28.74 180 top
C8  2.47,24.41 180 top
C9  35.42,8.55 0 top
C10  14.82,5.79 270 top
C11  13.01,3.71 90 top
C12  1.9,12.35 180 top
C13  30.02,18.42 90 top
C14  10.35,21.28 270 top
C15  29.69,14.07 180 top
C16  7.73,21.85 270 top
C17  12.55,21.25 270 top
C18  13.86,21.24 270 top
CHRG1  2.47,27.05 0 top
D1  7.75,3.91 270 bottom
D2  5.99,3.89 270 bottom
D3  35.27,10.22 180 top
DEBUG1  35.27,28.78 270 top
J1  2.15,17.75 270 top
J2  5,33 0 top
JP1  1.6,2.36 90 top
L1  18.23,27.83 0 top
LDO1  10.43,25.86 270 top
LED1  34.25,19.74 270 top
LED2  35.9,19.81 270 top
LED3  13.93,8.63 180 top
LED4  13.89,10.25 180 top
R1  1.08,33.27 90 top
R2  2.62,33.26 90 top
R3  34.14,23.17 90 top
R4  4.26,21.38 270 top
R5  2.2,21.39 90 top
R6  35.69,23.24 90 top
R7  5.58,29.9 0 top
R8  2.36,29.86 180 top
R9  35.39,11.81 180 top
R10  10.61,5.04 180 top
R11  10.39,2.77 180 top
R12  15.28,22.33 270 top
R13  10.63,8.15 0 top
R14  31.58,18.43 270 top
R15  10.68,10.29 0 top
R16  19.92,8.8 0 top
R17  19.95,10.57 0 top
RESET  35.46,14.93 90 top
SW1  34.71,35.76 180 top
SW3  21.33,4.02 180 top
SW4  31.78,4.06 180 top
U1  26.44,29.22 0 top
U2  5.38,7.15 270 top
U3  18.4,19.86 0 top
USB1  2.85,6.31 90 bottom
XTAL1  20.23,22.13 90 top

### Tracks (layer width: path | path; a pad name or v marks a point on that pad's centre or on a via)
3.3V
  Top 0.152: 2.73,8.73 U2.3 | R1.2 R2.2 7.7,34.11 J2.4
  pour Top: 0.18,32.72 37.8,32.72 37.8,0.36 0.25,0.36 0.25,0.33
!CTS
  Top 0.152: U2.9 1.71,4.92 1.2,4.41 1.2,3.16 JP1.2
A4/PPG  (via drill 0.35)
  Top 0.152: U1.5 20.99,27.92 v20.47,28.44
  Bottom 0.152: J2.7 12.62,30.78 15.48,27.92 19.95,27.92 v20.47,28.44
A5/TIA  (via drill 0.35)
  Top 0.152: U1.6 20.87,27.22 v20.5,27.59
  Bottom 0.152: v20.5,27.59 20.3,27.39 15.46,27.39 11.35,31.49 J2.6
A7/BATT  (via drill 0.35)
  Top 0.152: R5.2 2.21,22.23 R4.1 4.73,22.23 7.31,19.65 7.52,19.65 v7.54,19.63 | v20.43,25.83 21.83,25.83 U1.8
  Bottom 0.152: v7.54,19.63 7.52,19.63 14.27,19.63 20.29,25.66 20.3,25.66 20.43,25.78 v20.43,25.83
D3/RESET.OLED  (via drill 0.35)
  Top 0.152: U3.14 17.35,20.12 v17.57,20.35 | v25.07,24.41 25.17,24.31 25.17,21.7 U1.16
  Bottom 0.152: v17.57,20.35 17.62,20.35 21.68,24.41 v25.07,24.41
D4/DC.OLED  (via drill 0.35)
  Top 0.152: U3.15 18.05,19.88 v18.43,20.27 | v25.93,24.18 25.87,24.12 25.87,21.7 U1.17
  Bottom 0.152: v25.93,24.18 25.67,24.18 25.31,23.82 21.99,23.82 v18.43,20.27
D11/SW1
  Top 0.152: SW3.A1 32.49,13.46 32.49,21.56 U1.25
D15/SW2  (via drill 0.35)
  Top 0.152: SW4.A1 35.72,6.27 v33.49,6.27 | U1.29 31.29,25.59 31.93,25.59 32.12,25.4 32.12,22.37 32.83,21.66 32.83,13.12 30.75,11.05 v30.75,8.62
  Top 0.203: U1.29
  Bottom 0.152: v33.49,6.27 33.1,6.27 v30.75,8.62
D16/CS.OLED  (via drill 0.35)
  Top 0.152: U1.30 29.68,26.52 v29.66,26.5 | v16.72,20.34 16.6,20.22 16.6,18.71 U3.13
  Bottom 0.152: v29.66,26.5 22.62,26.5 16.72,20.59 v16.72,20.34
D27/CHRG.STATUS  (via drill 0.35)
  Top 0.152: R7.1 4.73,31.13 v4.76,31.17 11.43,31.17 13.84,28.75 v15.52,28.75 | v1.53,26.92 1.52,26.91 CHRG1.1 | v20.33,29.32 20.62,29.02 20.71,29.02 21.12,28.62 U1.4
  Bottom 0.152: v4.76,31.17 1.53,27.93 v1.53,26.92 | v20.33,29.32 | v20.33,29.32 19.76,28.75 v15.52,28.75
D30/LED.CTRL  (via drill 0.35)
  Top 0.152: U1.7 20.68,26.52 v20.47,26.73
  Bottom 0.152: v20.47,26.73 20.43,26.77 15.53,26.77 10.08,32.22 J2.5
DFU  (via drill 0.35)
  Top 0.152: SW1.3 36.33,36.58 36.47,36.58 36.46,36.56 v35.34,36.56 | v29.69,29.34 31.01,29.34 U1.34
  Bottom 0.152: v29.69,29.34 29.69,30 30.04,30.35 31.87,30.35 32.01,30.49 32.01,33.38 35.19,36.56 v35.34,36.56
DTR  (via drill 0.35)
  Top 0.152: U2.1 4.8,10.01 8.49,13.7 21.45,13.7 v21.68,13.47 | v23.55,11.6 23.55,5.51 24.3,4.76 30.78,4.76 C9.1
  Bottom 0.152: v23.55,11.6 v21.68,13.47
GND  (via drill 0.35)
  Top 0.152: C11.2 13.02,4.57 13.02,5.75 v13.08,5.75 | U3.1 7.57,18.66 v7.54,18.69 | v12.51,22.77 12.51,21.94 C17.1 | U3.8 v13.15,16.91 | C18.1 13.84,21.92 v13.84,22.79 | v15.3,24.34 15.23,24.27 15.23,23.22 R12.1 | U3.30 28.6,18.71 | SW3.B1 25.3,3.36 25.35,3.5 v25.38,3.48 | SW4.B1 35.76,3.32 35.82,3.49 v35.77,3.44 | U1.24 30.66,21.59 v31.62,21.59 | C10.1 13.84,6.64 v13.74,6.73 | R5.1 2.2,17.8 J1.1 | RESET.3 36.29,14.32 v36.27,14.33 | C15.1 v31.66,14.07 | C2.1 15.6,31.02 v15.55,31.07 | 3,12.6 C12.1 3.75,12.36 v3.83,12.27 | U2.16 7.33,7.46 v6.98,7.82 | JP1.1 2.33,1.95 v3.33,0.95 | SW1.1 34.83,34.94 32.66,32.77 v32.6,32.77 32.35,33.02 U1.39 | R8.1 3.21,29.45 2.62,28.86 2.62,26.72
  Top 0.203: C4.2 17.95,23.84 17.23,23.84 C3.1 16.79,23.61 16.79,24.73 v16.84,24.79 | U1.12 v21.44,21.57 v21.43,21.56 | U3.10 v14.56,16.89 | U3.12 15.95,16.89 v15.93,16.87 | U3.29 U3.30 28.55,16.85 | 28.55,16.85 v28.53,16.84 | R14.2 31.57,17.57 C13.1 29.26,17.57 28.55,16.85 | LED1.C 34.36,18.75 35.72,18.75 LED2.C 35.89,18.92 35.89,17.53 v35.92,17.5
  Top 0.356: v5.75,8.29 4.96,8.29 3.5,6.83 U2.6
  Top 0.457: C1.2 16.81,29.92 C2.1
  Top 0.508: U1.1 23.11,31.74 v23.23,31.74 | C8.2 1.95,24.74 1.97,24.74 2.47,25.25 CHRG1.2 v2.47,26.86 | 2.62,26.72 v2.47,26.86 | v2.47,26.86 v2.47,26.87
  Top 0.66: C5.1 4.04,26.69 3.9,26.83 2.5,26.83 v2.47,26.86 | C6.1 8.05,25.36 8.05,25.39 8.43,25.78 8.49,25.78 8.58,25.86 LDO1.2 9.15,25.89 v10.43,25.89 10.22,26.1 10.22,27.3 8.94,28.58 C7.2
  pour Bottom: 0.1,0.38 0.1,33 37.92,33 37.92,0.15 0.08,0.36 0.13,0.36
LED1
  Top 0.152: U1.31 32.02,27.22 33.14,26.1 33.14,25.02 R3.2
LED2
  Top 0.152: U1.33 32.56,28.62 33.48,27.7 33.48,25.65 34.03,25.1 35.46,25.1 35.7,24.86 R6.2
MOSI  (via drill 0.35)
  Top 0.152: U3.19 20.86,18.64 v20.86,15.93 v20.87,15.93 | v29.46,24.59 30.86,24.59 U1.27
  Bottom 0.152: v20.87,15.93 19.49,15.93 19.1,16.31 19.1,16.77 19.64,17.31 21.9,17.31 28.87,24.28 29.14,24.28 v29.46,24.59
N$1
  Top 0.152: R12.2 15.28,18.69 U3.11
N$2
  Top 0.203: R14.1 31.42,19.27 30.31,20.38 25.89,20.38 25.75,20.25 U3.26
N$3
  Top 0.152: C16.2 8.95,19.99 U3.2
N$4
  Top 0.152: U1.13 22.97,21.54 22.97,20.67 22.84,20.54 20.57,20.54 20.23,20.88 XTAL1.P$1 19.85,20.96 17.3,20.96 16.89,21.37 C3.2
N$5
  Top 0.152: U3.3 9.65,20.56 7.73,22.48 C16.1
N$6
  Top 0.203: U1.14 23.64,22.46 23.17,22.93 XTAL1.P$2 20.22,22.92 19.41,22.92 C4.1
N$7
  Top 0.152: C14.2 U3.4
N$8
  Top 0.152: C14.1 10.35,21.76 11.03,21.08 11.03,18.68 U3.5
N$9
  Top 0.152: R3.1 34.47,21.99 34.47,20.83 LED1.A
N$10
  Top 0.152: R6.1 35.9,22.18 LED2.A
N$11
  Top 0.457: L1.1 17.39,26.78 19.75,24.42 U1.10
N$12
  Top 0.457: C1.1 | C1.1 L1.2 19.31,27.61 19.31,25.73 19.95,25.09 21.81,25.09 U1.9
N$13
  Top 0.203: C13.2 29.71,19.27 28.95,20.03 27.18,20.03 27.15,19.99 U3.28
N$15
  Top 0.152: U3.27 26.45,14.77 27.14,14.07 C15.2
N$16
  Top 0.152: R8.2 CHRG1.5
N$17
  Top 0.152: R7.2 4.91,28.39 C5.2
  Top 0.66: CHRG1.4 3.46,28.39 C5.2
N$23
  Top 0.152: U2.12 9.64,4.92 R10.2
N$24
  Top 0.152: U2.11 8.06,3.22 8.51,2.77 R11.2
N$25
  Top 0.152: R13.2 12,8.67 13,8.67 LED3.C
N$26
  Top 0.152: R15.2 12.97,10.29 LED4.C
RESET  (via drill 0.35)
  Top 0.152: C9.2 36.27,10.06 D3.+ 36.42,11.63 36.29,11.76 | 36.29,11.76 R9.1 34.72,13.32 RESET.1 | DEBUG1.10 36.39,26.24 37,25.62 37,12.47 36.29,11.76 | v32.4,29.91 32.28,30.03 U1.35
  Bottom 0.152: 32.34,29.97 32.48,29.97 33.08,29.37 33.08,25.2 35,25.2 35.9,26.1 DEBUG1.10 | 32.34,29.97 | 32.34,29.97 v32.4,29.91
RXD.FT
  Top 0.152: R17.1 17.71,10.57 16.44,11.84 7.91,11.84 4.17,8.1 U2.4
RXD.NRF  (via drill 0.35)
  Top 0.152: U1.21 28.54,22.66 27.16,24.04 v27.16,24.51 | v19.93,11.98 19.93,9.64 R16.2
  Bottom 0.152: v27.16,24.51 25.89,23.25 25.89,22.55 21.26,17.92 19.38,17.92 18.49,17.03 18.49,16.06 19.93,14.62 v19.93,11.98
RXLED
  Top 0.152: U2.17 8.11,8.15 R13.1
SCK  (via drill 0.35)
  Top 0.152: U3.18 20.14,18.65 20.14,16.61 v20.12,16.6 | v29.11,23.7 31.01,23.7 U1.26
  Bottom 0.152: v20.12,16.6 22.01,16.6 v29.11,23.7
SCL  (via drill 0.35)
  Top 0.152: R2.1 4.56,32.41 4.7,32.27 5.54,32.27 J2.2 | v20.42,30.31 20.81,29.92 20.81,29.66 21.15,29.32 U1.3
  Bottom 0.152: J2.2 7.5,34.23 12.85,34.23 14.31,32.77 14.31,31.37 16.46,29.22 19.05,29.22 20.14,30.31 v20.42,30.31
SDA  (via drill 0.35)
  Top 0.152: R1.1 2.02,33.35 4.64,33.35 J2.1 | v20.6,32.24 21.84,31.01 U1.2
  Bottom 0.152: v20.6,32.24 20.55,32.29 18.76,32.29 16.36,34.69 6.42,34.69 5,33.27 J2.1
SWCLK  (via drill 0.35)
  Top 0.152: U1.36 31.07,30.75 32,30.75 33.75,32.5 35.83,32.5 36.92,31.41 v36.92,31.34
  Bottom 0.152: v36.92,31.34 36.92,30.4 36.57,30.05 DEBUG1.4
SWDIO
  Top 0.152: U1.37 32.13,31.42 33.55,32.84 36.41,32.84 37.52,31.73 37.52,30.32 36.91,30.32 DEBUG1.2
SWO  (via drill 0.35)
  Top 0.152: v32.41,27.86 32.35,27.92 U1.32
  Bottom 0.152: v32.41,27.86 32.41,25.07 32.61,24.87 35.89,24.87 36.92,25.89 36.92,28.51 36.65,28.78 DEBUG1.6
TXD.FT
  Top 0.152: R16.1 18.68,8.8 15.97,11.51 8.45,11.51 8.06,11.12 U2.20
TXD.NRF  (via drill 0.35)
  Top 0.152: U1.19 27.14,23.07 v26.99,23.22 | v20.98,12.21 20.98,10.74 R17.2
  Bottom 0.152: v26.99,23.22 21.39,17.61 19.51,17.61 18.8,16.9 18.8,16.19 20.98,14.01 v20.98,12.21
TXLED  (via drill 0.35)
  Top 0.152: R15.1 9.05,10.29 v8.64,10.7 | v6.96,9.96 6.38,9.38 6.38,8.1 5.99,7.71 5.78,7.71 3.65,5.58 3.65,4.52 3.43,4.29 U2.10
  Bottom 0.152: v8.64,10.7 7.69,10.7 6.96,9.97 v6.96,9.96
USB+  (via drill 0.35)
  Top 0.152: R11.1 12.92,2.77 C11.1 13.01,1.93 12.71,1.63 6.83,1.63 6.39,2.07 6.39,6.71 v6,7.1
  Bottom 0.152: USB1.3 5.2,6.31 v6,7.1
USB-  (via drill 0.35)
  Top 0.152: R10.1 11.46,5.74 12.18,6.46 13.2,6.46 14.71,4.94 C10.2 14.95,4.81 14.95,2.36 13.77,1.18 6.81,1.18 6,1.99 6,5.9 v5.81,6.09
  Bottom 0.152: USB1.2 5.38,5.66 v5.81,6.09
V_USB  (via drill 0.35)
  Top 0.152: U2.15 8.03,6.81 7.1,6.81 v6.95,6.96
  Bottom 0.152: v6.95,6.96 6.95,5.99 D2.+
  Bottom 0.406: D2.+ 5.96,5.01 4.37,5.02 USB1.1
VIN  (via drill 0.35)
  Top 0.152: 6.78,26.81 7.07,26.52 7.07,24.46 7.2,24.33 8.39,24.33 8.97,24.91 LDO1.3
  Top 0.66: v6.38,27.13 6.42,27.17 6.78,26.81 C6.2 LDO1.1
  Bottom 0.66: v6.38,27.13 6.38,26.12 5.13,24.87 5.13,15.39 9.47,11.05 9.47,5.4 7.74,3.66 7.74,2.74
  Bottom 0.711: D2.- 7.74,2.74 D1.-
VLIPO  (via drill 0.35)
  Top 0.152: R4.2 4.26,17.32 J1.2
  Top 0.66: CHRG1.3 3.42,24.51 C8.1 3.46,24.28 v3.46,23.18
  Bottom 0.66: v3.46,23.18 3.46,19.41 4.11,18.76 4.11,17.16 J1.2 4.79,12.56 4.79,12.34 6.12,11.01 6.12,9.61 6.61,9.12 6.85,9.12 7.82,8.16 7.82,6.65 7.75,6.59 D1.+

### Text on the board
tNames: +
bNames: +